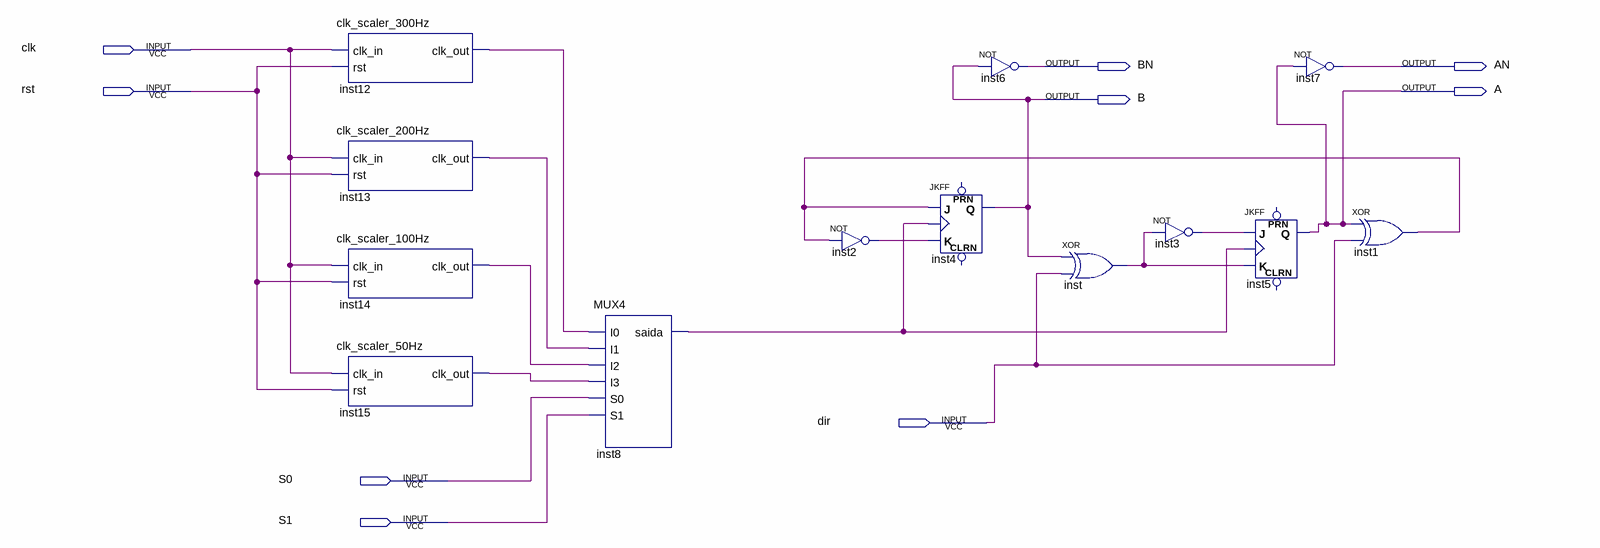
[diagram p0: schematic sheet]
// Quartus schematic motordepassos2.bdf as structural Verilog: 13 symbols, 9 pins
module motordepassos2 (
  input  clk,
  input  rst,
  input  dir,
  input  S0,
  input  S1,
  output BN,
  output AN,
  output A,
  output B
);

  wire inst1_out, inst2_out, inst3_out, inst8_saida, inst12_clk_out, inst13_clk_out, inst14_clk_out,
       inst15_clk_out, inst_out;

  clk_scaler_300Hz inst12 (.clk_in(clk), .rst(rst), .clk_out(inst12_clk_out));
  clk_scaler_200Hz inst13 (.clk_in(clk), .rst(rst), .clk_out(inst13_clk_out));
  clk_scaler_100Hz inst14 (.clk_in(clk), .rst(rst), .clk_out(inst14_clk_out));
  clk_scaler_50Hz inst15 (.clk_in(clk), .rst(rst), .clk_out(inst15_clk_out));
  MUX4 inst8 (
    .I0(inst12_clk_out), .I1(inst13_clk_out), .I2(inst14_clk_out), .I3(inst15_clk_out), .S0(S0), .S1(S1),
    .saida(inst8_saida));
  not inst2 (inst2_out, inst1_out);
  JKFF inst4 (.K(inst2_out), .J(inst1_out), .CLK(inst8_saida), .Q(B));  // open: PRN, CLRN
  not inst6 (BN, B);
  xor inst (inst_out, B, dir);
  not inst3 (inst3_out, inst_out);
  not inst7 (AN, A);
  JKFF inst5 (.K(inst_out), .J(inst3_out), .CLK(inst8_saida), .Q(A));  // open: PRN, CLRN
  xor inst1 (inst1_out, A, dir);
endmodule
